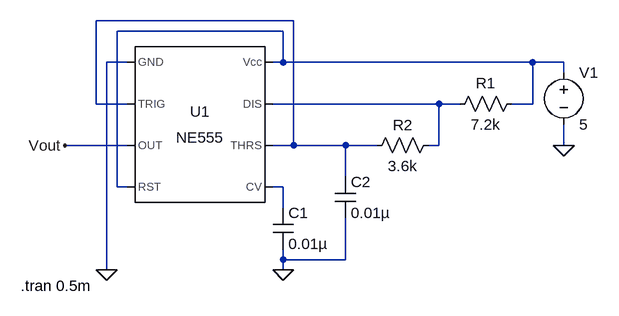
[diagram p0: schematic Astable_75.asc]
Astable_75.asc, the LTspice schematic file:
Version 4
SHEET 1 880 680
WIRE 352 16 48 16
WIRE 336 32 80 32
WIRE 96 80 64 80
WIRE 336 80 336 32
WIRE 336 80 320 80
WIRE 720 80 336 80
WIRE 768 80 720 80
WIRE 768 96 768 80
WIRE 48 144 48 16
WIRE 96 144 48 144
WIRE 576 144 320 144
WIRE 608 144 576 144
WIRE 720 144 720 80
WIRE 720 144 688 144
WIRE 96 208 0 208
WIRE 352 208 352 16
WIRE 352 208 320 208
WIRE 432 208 352 208
WIRE 480 208 432 208
WIRE 576 208 576 144
WIRE 576 208 560 208
WIRE 768 208 768 176
WIRE 432 256 432 208
WIRE 80 272 80 32
WIRE 96 272 80 272
WIRE 336 272 320 272
WIRE 336 304 336 272
WIRE 336 384 336 368
WIRE 432 384 432 320
WIRE 432 384 336 384
WIRE 64 400 64 80
WIRE 336 400 336 384
FLAG 336 400 0
FLAG 64 400 0
FLAG 768 208 0
FLAG 0 208 Vout
SYMBOL Misc\\NE555 208 176 R0
SYMATTR InstName U1
SYMBOL cap 320 304 R0
SYMATTR InstName C1
SYMATTR Value 0.01µ
SYMBOL voltage 768 80 R0
WINDOW 123 0 0 Left 0
WINDOW 39 0 0 Left 0
SYMATTR InstName V1
SYMATTR Value 5
SYMBOL res 704 128 R90
WINDOW 0 0 56 VBottom 2
WINDOW 3 32 56 VTop 2
SYMATTR InstName R1
SYMATTR Value 7.2k
SYMBOL res 576 192 R90
WINDOW 0 0 56 VBottom 2
WINDOW 3 32 56 VTop 2
SYMATTR InstName R2
SYMATTR Value 3.6k
SYMBOL cap 416 256 R0
SYMATTR InstName C2
SYMATTR Value 0.01µ
TEXT -68 424 Left 2 !.tran 0.5m

The netlist it stands for:
* Astable_75.asc
XU1 0 N001 Vout N002 N004 N001 N003 N002 NE555  ; pins GND TRIG OUT RST CV THRS DIS Vcc
C1 N004 0 0.01µ
V1 N002 0 5
R1 N002 N003 7.2k
R2 N003 N001 3.6k
C2 N001 0 0.01µ
.tran 0.5m
.lib NE555.sub
.backanno
.end